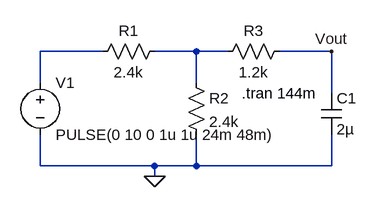
[diagram p0: schematic 21101298_CSE250_1(iii).asc]
21101298_CSE250_1(iii).asc, the LTspice schematic file:
Version 4
SHEET 1 880 680
WIRE -32 80 -128 80
WIRE 112 80 48 80
WIRE 160 80 112 80
WIRE 320 80 240 80
WIRE -128 128 -128 80
WIRE 112 128 112 80
WIRE 320 144 320 80
WIRE -128 256 -128 208
WIRE 48 256 -128 256
WIRE 112 256 112 208
WIRE 112 256 48 256
WIRE 320 256 320 208
WIRE 320 256 112 256
WIRE 48 272 48 256
FLAG 48 272 0
FLAG 320 80 Vout
SYMBOL voltage -128 112 R0
WINDOW 123 0 0 Left 0
WINDOW 39 0 0 Left 0
SYMATTR InstName V1
SYMATTR Value PULSE(0 10 0 1u 1u 24m 48m)
SYMBOL res -48 96 R270
WINDOW 0 32 56 VTop 2
WINDOW 3 0 56 VBottom 2
SYMATTR InstName R1
SYMATTR Value 2.4k
SYMBOL res 96 112 R0
SYMATTR InstName R2
SYMATTR Value 2.4k
SYMBOL res 144 96 R270
WINDOW 0 32 56 VTop 2
WINDOW 3 0 56 VBottom 2
SYMATTR InstName R3
SYMATTR Value 1.2k
SYMBOL cap 304 144 R0
SYMATTR InstName C1
SYMATTR Value 2µ
TEXT 182 144 Left 2 !.tran 144m

The netlist it stands for:
* 21101298_CSE250_1(iii).asc
V1 N001 0 PULSE(0 10 0 1u 1u 24m 48m)
R1 N001 N002 2.4k
R2 N002 0 2.4k
R3 N002 Vout 1.2k
C1 Vout 0 2µ
.tran 144m
.backanno
.end